# Altium schematic sheet e-stim.SchDoc
size C
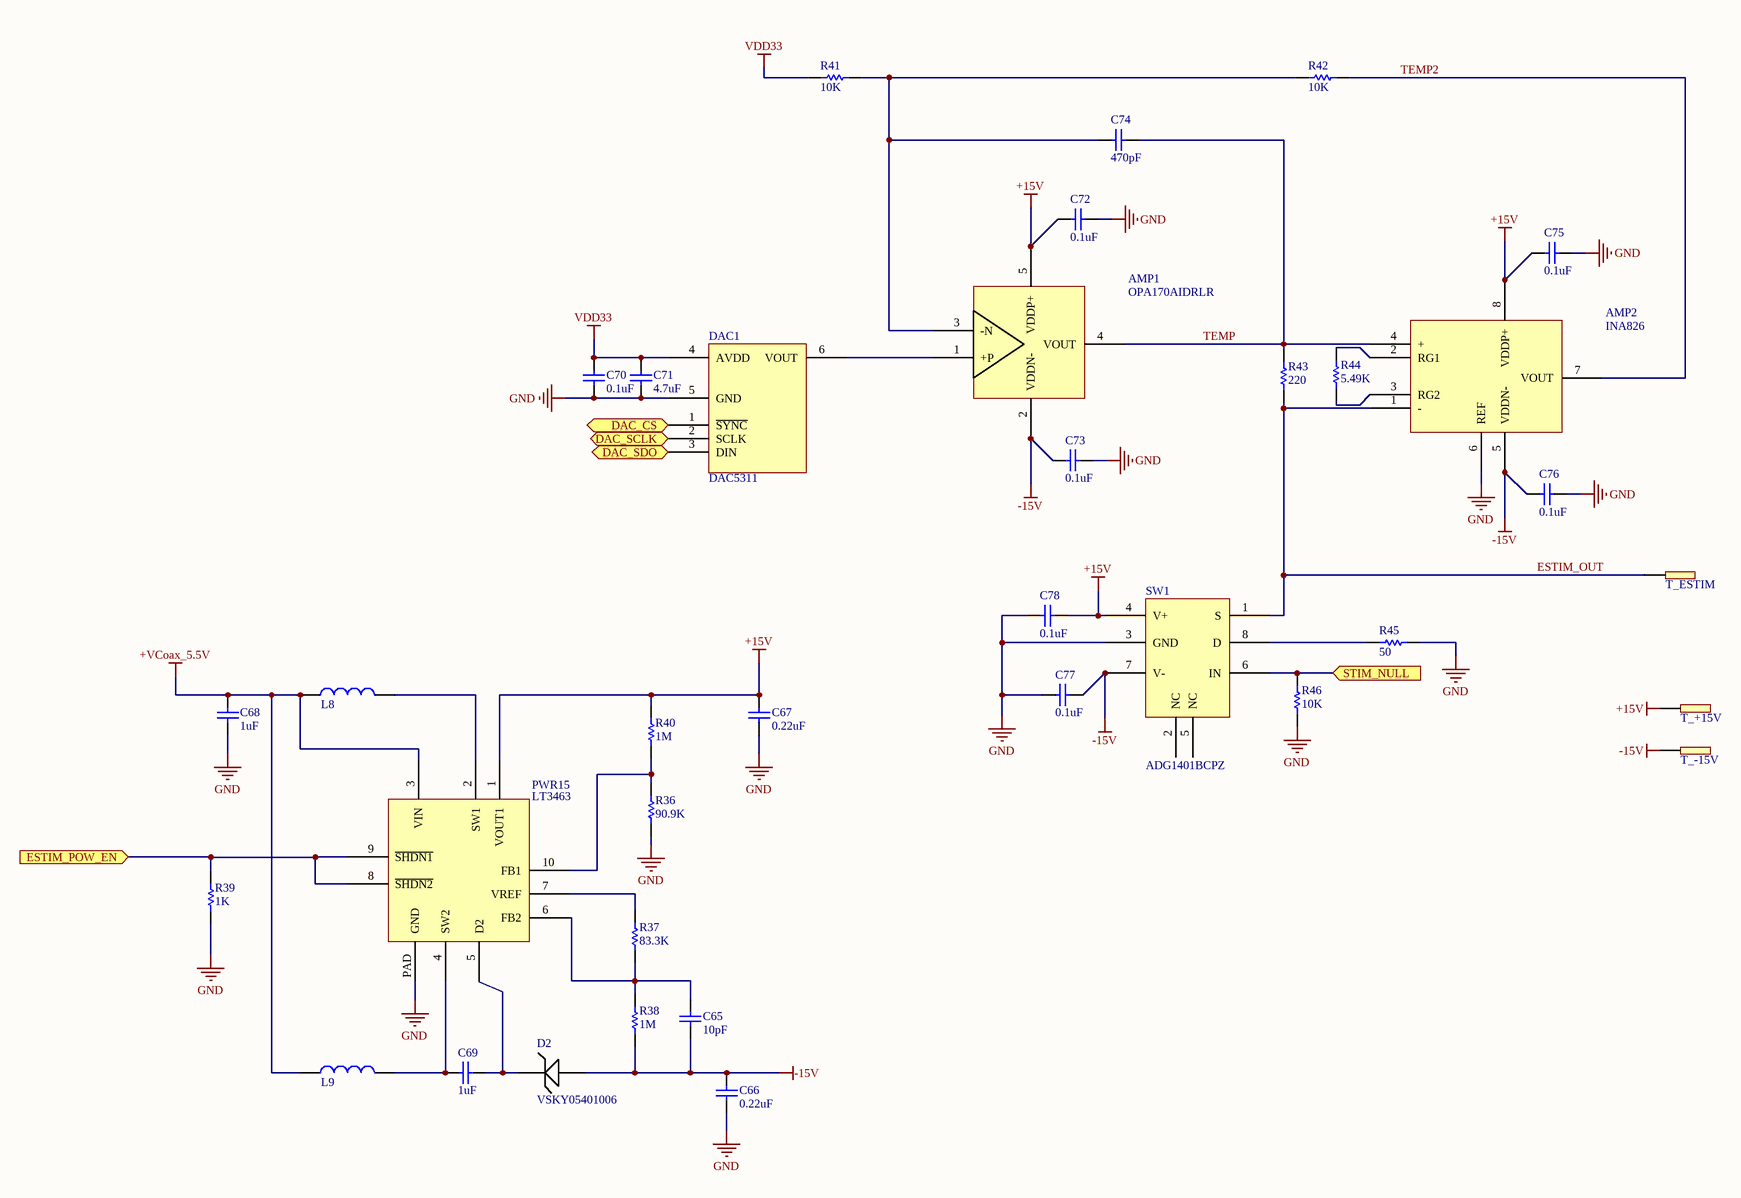
[diagram p0: e-stim.SchDoc]

## Parts
AMP1  OPA170AIDRLR  [OPA170-DRL]
AMP2  INA826  [INA826AIDRGR]
C65  value 10pF  [Cap-0603]  (hidden comment: X7R Ceramic)
C66  value 0.22uF  [Cap-0603]  (hidden comment: X7R Ceramic)
C67  value 0.22uF  [Cap-0603]  (hidden comment: X7R Ceramic)
C68  value 1uF  [Cap-0603]  (hidden comment: X7R Ceramic)
C69  value 1uF  [Cap-0603]  (hidden comment: X7R Ceramic)
C70  value 0.1uF  [Cap_0402]  (hidden comment: X7R Ceramic)
C71  value 4.7uF  [Cap_0402]  (hidden comment: X7R Ceramic)
C72  value 0.1uF  [Cap_0402]  (hidden comment: X7R Ceramic)
C73  value 0.1uF  [Cap_0402]  (hidden comment: X7R Ceramic)
C74  value 470pF  [Cap_0402]  (hidden comment: X7R Ceramic)
C75  value 0.1uF  [Cap_0402]  (hidden comment: X7R Ceramic)
C76  value 0.1uF  [Cap_0402]  (hidden comment: X7R Ceramic)
C77  value 0.1uF  [Cap_0402]  (hidden comment: X7R Ceramic)
C78  value 0.1uF  [Cap_0402]  (hidden comment: X7R Ceramic)
D2  VSKY05401006  [Cap_0402]
DAC1  DAC5311  [DAC5311]
L8  Ferrite Bead  [MLZ2012M100WT000]  (value not drawn)
L9  Ferrite Bead  [MLZ2012M100WT000]  (value not drawn)
PWR15  LT3463  [LT3463]
R36  value 90.9K  [Res_0402]  (hidden comment: Res1)
R37  value 83.3K  [Res_0402]  (hidden comment: Res1)
R38  value 1M  [Res_0402]  (hidden comment: Res1)
R39  value 1K  [Res_0402]  (hidden comment: Res1)
R40  value 1M  [Res_0402]  (hidden comment: Res1)
R41  value 10K  [Res_0402]  (hidden comment: Res1)
R42  value 10K  [Res_0402]  (hidden comment: Res1)
R43  value 220  [Res_0402]  (hidden comment: Res1)
R44  value 5.49K  [Res_0402]  (hidden comment: Res1)
R45  value 50  [Res_0402]  (hidden comment: Res1)
R46  value 10K  [Res_0402]  (hidden comment: Res1)
SW1  ADG1401BCPZ  [ADG1401BCPZ]
T_+15V  Header_1PIN  [JUMPER1PIN]  (value not drawn)
T_-15V  Header_1PIN  [JUMPER1PIN]  (value not drawn)
T_ESTIM  Header_1PIN  [JUMPER1PIN]  (value not drawn)

## Ports
DAC_CS (in), DAC_SCLK (in), DAC_SDO (in), ESTIM_POW_EN (in), STIM_NULL (in)

## Nets
+15V: AMP1.5(VDDP+) AMP2.8(VDDP+) C67.1 C72.1 C75.1 C78.2 PWR15.1(VOUT1) R40.2 SW1.4(V+) T_+15V.0
+VCoax_5.5V: C68.1 L8.1 L9.1 PWR15.3(VIN)
-15V: AMP1.2(VDDN-) AMP2.5(VDDN-) C65.2 C66.1 C73.1 C76.1 C77.2 D2.2 R38.1 SW1.7(V-) T_-15V.0
GND: AMP2.6(REF) C66.2 C67.2 C68.2 C70.2 C71.2 C72.2 C73.2 C75.2 C76.2 C77.1 C78.1 DAC1.5(GND) PWR15.PAD(GND) R36.1 R39.1 R45.2 R46.1 SW1.3(GND)
VDD33: C70.1 C71.1 DAC1.4(AVDD) R41.2
DAC_CS: DAC1.1(~{SYNC}) ; port DAC_CS
DAC_SCLK: DAC1.2(SCLK) ; port DAC_SCLK
DAC_SDO: DAC1.3(DIN) ; port DAC_SDO
ESTIM_OUT: AMP2.1(-) R43.2 SW1.1(S) T_ESTIM.0
ESTIM_POW_EN: PWR15.8(~{SHDN2}) PWR15.9(~{SHDN1}) R39.2 ; port ESTIM_POW_EN
STIM_NULL: R46.2 SW1.6(IN) ; port STIM_NULL
TEMP: AMP1.4(VOUT) AMP2.4(+) C74.2 R43.1
TEMP2: AMP2.7(VOUT) R42.1
NetAMP1_1: AMP1.1(+P) DAC1.6(VOUT)
NetAMP1_3: AMP1.3(-N) C74.1 R41.1 R42.2
NetAMP2_2: AMP2.2(RG1) R44.1
NetAMP2_3: AMP2.3(RG2) R44.2
NetC65_1: C65.1 PWR15.6(FB2) R37.1 R38.2
NetC69_1: C69.1 D2.1 PWR15.5(D2)
NetC69_2: C69.2 L9.2 PWR15.4(SW2)
NetL8_2: L8.2 PWR15.2(SW1)
NetPWR15_7: PWR15.7(VREF) R37.2
NetPWR15_10: PWR15.10(FB1) R36.2 R40.1
NetR45_1: R45.1 SW1.8(D)

Not connected (* = marked no-connect by the designer): SW1 2(NC) 5(NC)

## Library data of the parts
C65-C78 = Cap: Capacitor; Published: 8-Jun-2000; LatestRevisionDate: 17-Jul-2002; LatestRevisionNote: Re-released for DXP Platform.; PackageReference: RAD-0.3; Publisher: Altium Limited; PackageDescription: Radial Cap, Thru-Hole; 2 Leads; 0.3 in Pin Spacing
R36-R46 = Res1: Resistor; Published: 8-Jun-2000; LatestRevisionDate: 17-Jul-2002; LatestRevisionNote: Re-released for DXP Platform.; PackageReference: AXIAL-0.3; Publisher: Altium Limited; PackageDescription: Axial Device, Thru-Hole; 2 Leads; 0.3 in Pin Spacing